# Altium schematic sheet mp9943_evb.SchDoc
size A4; DocumentNumber: 1; SheetNumber: 1; SheetTotal: 1
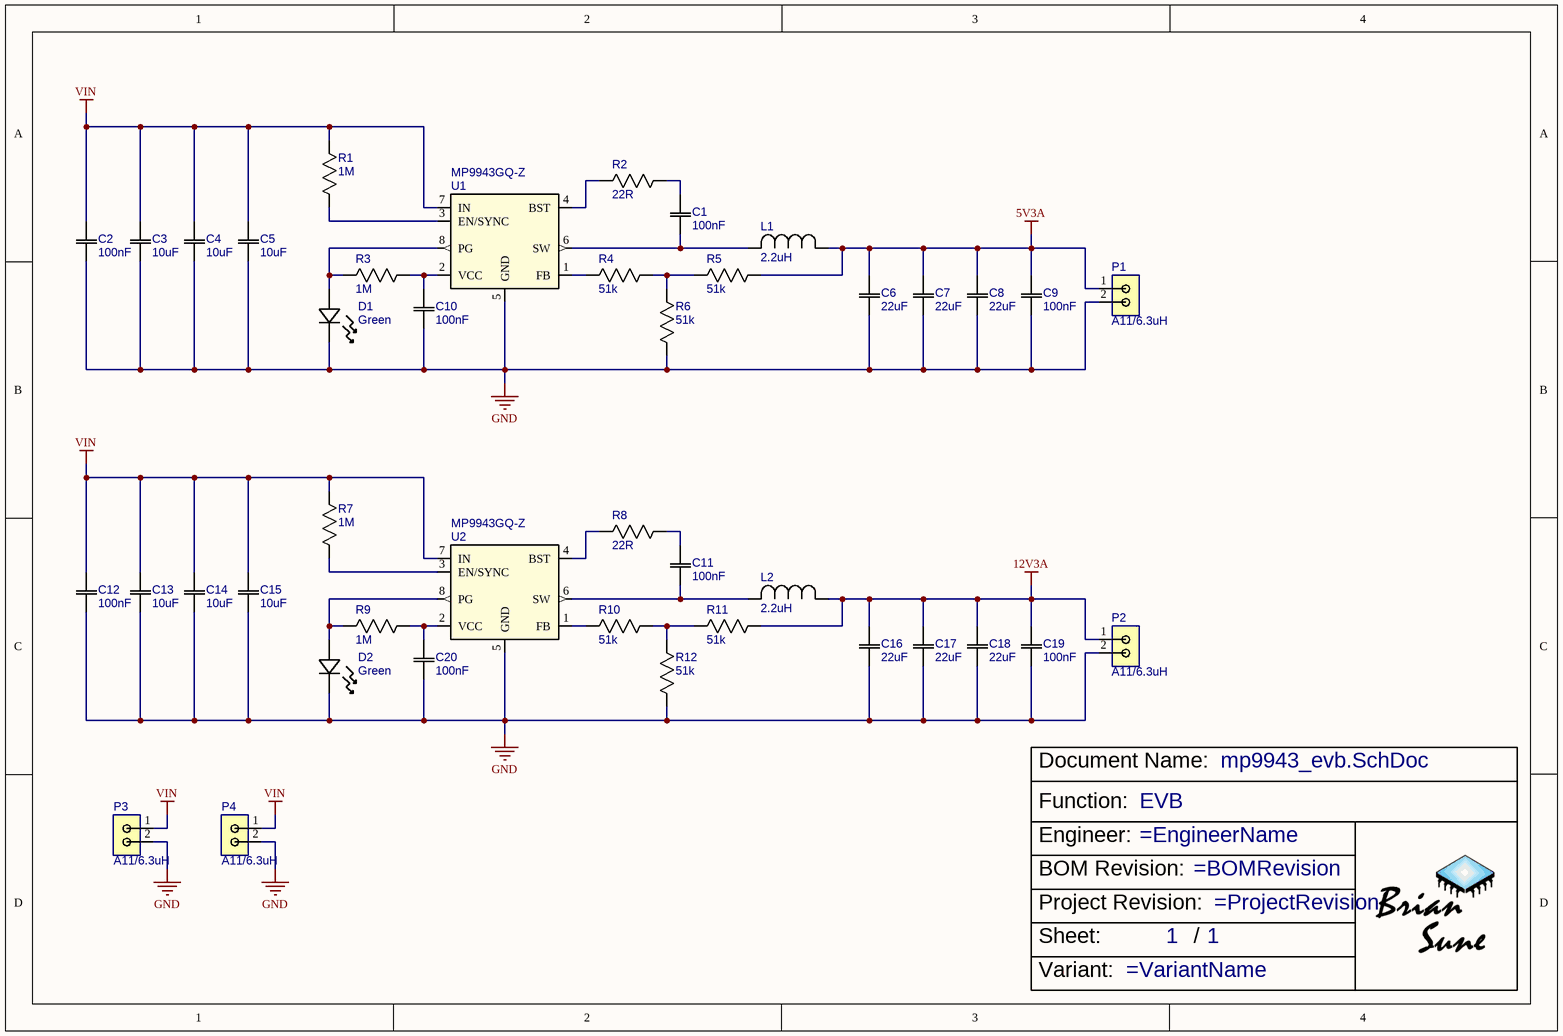
[diagram p0: mp9943_evb.SchDoc]

## Parts
?  Function: EVB  (hidden comment: TitleBlock)  (graphical)
C1  100nF  [C0603]
C2  100nF  [C0603]
C3  10uF  [C0603]
C4  10uF  [C0603]
C5  10uF  [C0603]
C6  22uF  [C0603]
C7  22uF  [C0603]
C8  22uF  [C0603]
C9  100nF  [C0603]
C10  100nF  [0402]
C11  100nF  [C0603]
C12  100nF  [C0603]
C13  10uF  [C0603]
C14  10uF  [C0603]
C15  10uF  [C0603]
C16  22uF  [C0603]
C17  22uF  [C0603]
C18  22uF  [C0603]
C19  100nF  [C0603]
C20  100nF  [0402]
D1  Green  [LED_SML-LX0603GW-TR_LUM]
D2  Green  [LED_SML-LX0603GW-TR_LUM]
L1  2.2uH  [IND_1040-WE-LHMI_WRE]
L2  2.2uH  [IND_1040-WE-LHMI_WRE]
P1  A11/6.3uH  [2x3mmPad]
P2  A11/6.3uH  [2x3mmPad]
P3  A11/6.3uH  [2x3mmPad]
P4  A11/6.3uH  [2x3mmPad]
R1  1M  [0402]
R2  22R  [0402]
R3  1M  [0402]
R4  51k  [0402]
R5  51k  [0402]
R6  51k  [0402]
R7  1M  [0402]
R8  22R  [0402]
R9  1M  [0402]
R10  51k  [0402]
R11  51k  [0402]
R12  51k  [0402]
U1  MP9943GQ-Z  [QFN8_3x3_NEP]
U2  MP9943GQ-Z  [QFN8_3x3_NEP]

## Nets
5V3A: C6.2 C7.2 C8.2 C9.2 L1.1 P1.1(P0) R5.2
12V3A: C16.2 C17.2 C18.2 C19.2 L2.1 P2.1(P0) R11.2
GND: C2.1 C3.1 C4.1 C5.1 C6.1 C7.1 C8.1 C9.1 C10.1 C12.1 C13.1 C14.1 C15.1 C16.1 C17.1 C18.1 C19.1 C20.1 D1.1 D2.1 P1.2(P1) P2.2(P1) P3.2(P1) P4.2(P1) R6.1 R12.1 U1.5(GND) U2.5(GND)
VIN: C2.2 C3.2 C4.2 C5.2 C12.2 C13.2 C14.2 C15.2 P3.1(P0) P4.1(P0) R1.2 R7.2 U1.7(IN) U2.7(IN)
NetC1_1: C1.1 L1.2 U1.6(SW)
NetC1_2: C1.2 R2.2
NetC10_2: C10.2 R3.1 U1.2(VCC)
NetC11_1: C11.1 L2.2 U2.6(SW)
NetC11_2: C11.2 R8.2
NetC20_2: C20.2 R9.1 U2.2(VCC)
NetD1_2: D1.2 R3.2 U1.8(PG)
NetD2_2: D2.2 R9.2 U2.8(PG)
NetR1_1: R1.1 U1.3(EN/SYNC)
NetR2_1: R2.1 U1.4(BST)
NetR4_1: R4.1 U1.1(FB)
NetR4_2: R4.2 R5.1 R6.2
NetR7_1: R7.1 U2.3(EN/SYNC)
NetR8_1: R8.1 U2.4(BST)
NetR10_1: R10.1 U2.1(FB)
NetR10_2: R10.2 R11.1 R12.2

## Notes on the sheet
- (in symbol TitleBlock) Document Name:; Function:; Engineer:; BOM Revision:; Project Revision:; Sheet:; /; Variant:

## Library data of the parts
C1 C2 C9 C11 C12 C19 = taobao_100nF: 104P 50V 0.1UF 100NF; Mfr.: Your Cee; ComponentLink1Description: taobao; ComponentLink1URL: https://item.taobao.com/item.htm?spm=a1z09.2.0.0.37a92e8dhQcjld&id=522573286298&_u=k10quk0k8828; Mfr. No: 104P; Price: 0.01
C3-C5 C13-C15 = taobao_10uF: OUDEIBUN / 50V 10% 106K X5R; Mfr. No: 106; ComponentLink1Description: taobao; ComponentLink1URL: https://detail.tmall.com/item.htm?abbucket=11&id=610884231672&rn=bfecce7903ee26d41e055cbdf2d2e6eb&spm=a1z10.3-b.w4011-22147617817.28.ed547d1efUUngR&skuId=4463564134689; Mfr.: OUDEIBUN; Price: 0.2
C6-C8 C16-C18 = taobao_22uF: OUDEIBUN / 25V 10% 226K X5R; Mfr. No: 226; ComponentLink1Description: taobao; ComponentLink1URL: https://detail.tmall.com/item.htm?abbucket=11&id=610150156146&rn=59afea97bc42016507be0d5449395d39&spm=a1z10.3-b.w4011-22147617817.29.2b4e7d1e4hXUjj&skuId=4292454384286; Mfr.: OUDEIBUN; Price: 0.6
C10 C20 = CC0402KRX7R9BB104: 100nF(104) +/-10% 50V X7R CC0402KRX7R9BB104; Mfr.: YAGEO; Mfr. No: CC0402KRX7R9BB104; ComponentLink2Description: taobao; ComponentLink2URL: https://item.taobao.com/item.htm?spm=a1z09.2.0.0.6cd22e8dvd0KRh&id=635612378955&_u=j10quk0kc6c7; Price: 0.03
D1 D2 = 0603LED_GREEN: Your Cee / (SMD) Green; Mfr. No: Green 2.9V; Mfr.: Your Cee; ComponentLink1Description: taobao; ComponentLink1URL: https://item.taobao.com/item.htm?spm=2013.1.0.0.379c29f8uyF9g1&id=522573309525; Price: 0.04
L1 L2 = L1040_222: OUDEIBUN / 11.6x10.1mm SMD Power Inductor; Mfr. No: 1040; Mfr.: OUDEIBUN; Price: 0.6; ComponentLink1Description: taobao; ComponentLink1URL: https://detail.tmall.com/item.htm?_u=o10quk0kcd81&id=610494207981&spm=a1z09.2.0.0.7bbe2e8deqhCM3
P1-P4 = A11_QI_6u3H_DUAL: Mfr.: Huihai Longteng; Mfr. No: A11; ComponentLink1Description: taobao; ComponentLink1URL: https://item.taobao.com/item.htm?spm=a1z09.2.0.0.f1702e8dvag9Bh&id=535912863390&_u=f10quk0kb827; Price: 8.00
R1 R3 R7 R9 = taobao_1Meg: UNIOHM / 1M 1000K 1%; Mfr. No: 1MEG; ComponentLink1Description: taobao; ComponentLink1URL: https://item.taobao.com/item.htm?spm=a1z10.3-c-s.w4002-24706531953.48.69756a4bbhcoqL&id=525647000065; Price: 0.012; Mfr.: UNIOHM
R2 R8 = taobao_22R: UNIOHM / 22R 1% 1/16W; ComponentLink1Description: taobao; ComponentLink1URL: https://item.taobao.com/item.htm?spm=a1z10.3-c-s.w4002-24706531953.22.fbb46a4bEDE57N&id=525596482937; Mfr.: UNIOHM; Mfr. No: 22R; Price: 0.012
R4-R6 R10-R12 = taobao_51k: OUDEIBUN / 1% 51k; ComponentLink1Description: taobao; ComponentLink1URL: https://detail.tmall.com/item.htm?abbucket=11&id=609307671775&rn=0149e1b5fdb20f46b57f4aa09e0d88dd&spm=a1z10.3-b.w4011-22147617817.31.43dc7d1emjXWoJ&skuId=4447096026291; Mfr.: OUDEIBUN; Mfr. No: 51k; Price: 0.02
U1 U2 = MP9943GQ-Z: High Efficiency 3A Peak, 36V, Synchronous Step Down Converter with Power Good; Mfr.: Monolithic Power Systems (MPS); Mfr. No: MP9943GQ-Z; Price: 1.89; ComponentLink1Description: taobao; ComponentLink1URL: https://item.taobao.com/item.htm?spm=a230r.1.14.1.1b772dc2TjPeUb&id=665665975436&ns=1&abbucket=5#detail